# Altium schematic sheet Power Regulation.SchDoc
size B; Organization: MASA; SheetNumber: 7; SheetTotal: 7
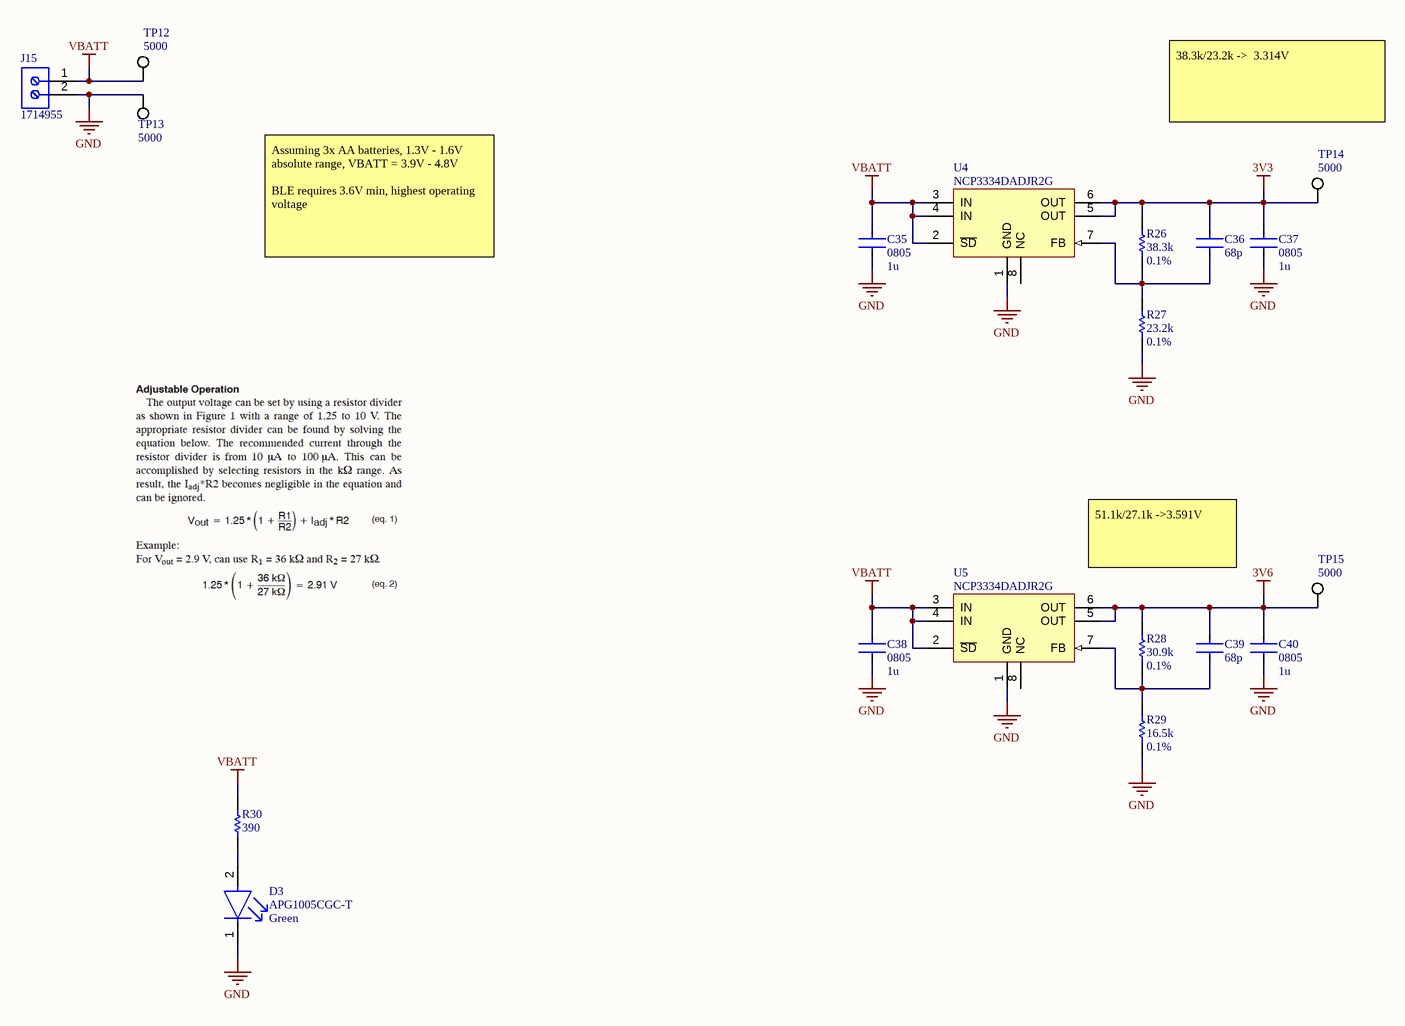
[diagram p0: Power Regulation.SchDoc]

## Parts
C35  value 1u  Package: 0805  [FP-0805-Capacitor-CL21-IPC_B]  (hidden comment: Ceramic Capacitor 0805)
C36  value 68p  [FP-0603-Capacitor-CL10-IPC_B]  (hidden comment: Ceramic Capacitor 0603)
C37  value 1u  Package: 0805  [FP-0805-Capacitor-CL21-IPC_B]  (hidden comment: Ceramic Capacitor 0805)
C38  value 1u  Package: 0805  [FP-0805-Capacitor-CL21-IPC_B]  (hidden comment: Ceramic Capacitor 0805)
C39  value 68p  [FP-0603-Capacitor-CL10-IPC_B]  (hidden comment: Ceramic Capacitor 0603)
C40  value 1u  Package: 0805  [FP-0805-Capacitor-CL21-IPC_B]  (hidden comment: Ceramic Capacitor 0805)
D3  APG1005CGC-T  Color: Green  [FP-APG1005CGC-T-MFG]
J15  1714955  [1714955]
R26  value 38.3k  Tolerance: 0.1%  [RESC1608X55X25NL10T15]  (hidden comment: RC0603FR-072K2L)
R27  value 23.2k  Tolerance: 0.1%  [RESC1608X55X25NL10T15]  (hidden comment: RC0603FR-072K2L)
R28  value 30.9k  Tolerance: 0.1%  [RESC1608X55X25NL10T15]  (hidden comment: RC0603FR-072K2L)
R29  value 16.5k  Tolerance: 0.1%  [RESC1608X55X25NL10T15]  (hidden comment: RC0603FR-072K2L)
R30  value 390  [RESC1608X55X25NL10T15]  (hidden comment: RC0603FR-072K2L)
TP12  5000  [FP-5000-MFG]
TP13  5000  [FP-5000-MFG]
TP14  5000  [FP-5000-MFG]
TP15  5000  [FP-5000-MFG]
U4  NCP3334DADJR2G  [NCP3334DADJR2G]
U5  NCP3334DADJR2G  [NCP3334DADJR2G]

## Nets
3V3: C36.1 C37.1 R26.2 TP14.1 U4.5(OUT) U4.6(OUT)
3V6: C39.1 C40.1 R28.2 TP15.1 U5.5(OUT) U5.6(OUT)
GND: C35.2 C37.2 C38.2 C40.2 D3.1(C) J15.2 R27.1 R29.1 TP13.1 U4.1(GND) U5.1(GND)
VBATT: C35.1 C38.1 J15.1 R30.2 TP12.1 U4.2(~{SD}) U4.3(IN) U4.4(IN) U5.2(~{SD}) U5.3(IN) U5.4(IN)
NetC36_2: C36.2 R26.1 R27.2 U4.7(FB)
NetC39_2: C39.2 R28.1 R29.2 U5.7(FB)
NetD3_2: D3.2(A) R30.1

Not connected (* = marked no-connect by the designer): U4 8(NC); U5 8(NC)

## Notes on the sheet
- 38.3k/23.2k ->  3.314V
- Assuming 3x AA batteries, 1.3V - 1.6V absolute range, VBATT = 3.9V - 4.8V
  BLE requires 3.6V min, highest operating voltage
- 51.1k/27.1k ->3.591V
- DWG. NO.
- REV.
- SHT.
- THIS DOCUMENT AND THE DATA DISCLOSED HEREIN OR HEREWITH IS THE PROPERTY OF ALTIUM LIMITED AND MAY BE FREELY DISTRIBUTED IN WHOLE. NO RIGHTS ARE RESERVED OR EXPRESS OR IMPLIED WARANTEE GIVEN.
- REVISION
- DESCRIPTION
- DATE
- APPROVED
- ENG:
- APPROVALS
- PROJECT
- DSN:
- CHK:
- REFERENCE DOCUMENTS
- PROJECT REVISION:
- TITLE
- DOCUMENT REVISION:
- DESIGN ITEM:
- BOM:
- FAB DWG:
- PCB DWG:
- ASSY DWG:
- SCALE:
- SIZE
- B
- CAGE CODE
- FILE NAME
- DWG NO.
- SHEET
- OF
- REV

## Library data of the parts
C35 C37 C38 C40 = Ceramic Capacitor 0805: CAP CER 50V X7R 0805; Manufacturer: KEMET; Manufacturer Part Number: C0603C104K5RACTU; Tolerance: 0.1; Temperature Coefficient: 30ppm/°C; Automotive Grade: Grade 1; Temperature: -55°C to +125°C; RoHS: TRUE; Material: Ceramic; Temperature Range High: +125°C; Lead Free: Yes; Octopart: https://octopart.com/c0603c104k5ractu-kemet-139244; Digikey Description: CAP CER 0.1UF 50V X7R 0603; Category: Cap; ComponentLink2Description: Datasheet; Temperature Range Low: -55°C; Device Class L1: Passive Components; Voltage Rating: 50 V; Automotive: Yes; Device Class L3: Ceramic Capacitors; ComponentLink2URL: https://api.kemet.com/component-edge/download/datasheet/C0603C100J5GACAUTO.pdf; Device Class L2: Capacitors; Temperature Characteristic: X7R; Height: 0.87mm; Supplier 1: Arrow Electronics; Supplier Part Number 1: CL21B105KBFNNNG
C36 C39 = Ceramic Capacitor 0603: CAP CER 50V X7R 0603; Manufacturer: KEMET; Manufacturer Part Number: C0603C104K5RACTU; Tolerance: 0.1; Temperature Coefficient: 30ppm/°C; Automotive Grade: Grade 1; Temperature: -55°C to +125°C; RoHS: TRUE; Material: Ceramic; Temperature Range High: +125°C; Lead Free: Yes; Octopart: https://octopart.com/c0603c104k5ractu-kemet-139244; Digikey Description: CAP CER 0.1UF 50V X7R 0603; Category: Cap; Package: C0603C-CF; ComponentLink2Description: Datasheet; Temperature Range Low: -55°C; Device Class L1: Passive Components; Voltage Rating: 50 V; Automotive: Yes; Device Class L3: Ceramic Capacitors; ComponentLink2URL: https://api.kemet.com/component-edge/download/datasheet/C0603C100J5GACAUTO.pdf; Device Class L2: Capacitors; Temperature Characteristic: X7R; Height: 0.87mm; Supplier 1: Mouser; Supplier Part Number 1: 80-C0201C120K3G
D3 = APG1005CGC-T: LED GREEN CLEAR CHIP SMD; Forward Voltage: 2V; Lens Color: Colorless; Test Current: 20mA; Dominant Wavelength: 571nm; Viewing Angle: 120°; Luminous Intensity: 35mcd; Width: 0.5mm; Case Code (Imperial): 0402; Package Quantity: 1; Case/Package: 0402; Packaging: Tape and Reel; Height: 0.25mm; Mount: Surface Mount; Case Code (Metric): 1005; Length: 1mm; Lead Free: Lead Free; Lens Transparency: Clear; Supplier 1: Digi-Key; Supplier Part Number 1: 754-1811-1-ND
J15 = 1714955: PC Terminal Block, Pitch 6.35 mm, 1 x 2 Position, Height 21.5 mm, Tail Lenght 5.1 mm, RoHS, Bulk; Manufacturer: Phoenix Contact; Package Description: PC Terminal Block, Pitch 6.35 mm, 1 x 2 Position, Height 21.5 mm, Tail Lenght 5.1 mm; Datasheet URL: http://media.digikey.com/pdf/Data%20Sheets/Phoenix%20Contact%20PDFs/1714955.pdf; Package Reference: 1714955; Manufacturer URL: http://www.phoenixcontact.com/; Datasheet Version: 02/2010; Mounting Technology: ThroughHole; Supplier 1: Arrow Electronics; Supplier Part Number 1: 1714955
R26-R30 = Resistor 0603: Thick Film Resistor, 2.2 KOhm, 100 mW, 50 V, +/- 1%, -55 to 155 degC, 2-Pin SMD (0603), RoHS, Tape and Reel; Manufacturer: Yageo; Temperature Coefficient: 100PPM/C; Voltage Rating: 50V; Power Rating: 100mW; Datasheet Version: Rev. 7, 05/2017; Case Code - mm: 1608; Series: RC; Mounting Technology: SurfaceMount; Package Description: 2-Pin Surface Mount Device, Body 1.6 x 0.8 mm; Case Code - in: 0603; Package Reference: 0603; Product: ThickFilmResistorsGeneralPurpose; Manufacturer URL: http://www.yageo.com/; Termination Style: SMD/SMT; Operating Temperature Range: -55Cto+155C; Datasheet URL: http://www.yageo.com/documents/recent/PYu-RC_Group_51_RoHS_L_7.pdf; Packaging: Reel
  R30: Tolerance: 1%
TP12-TP15 = 5000: Red PC Test Point, Miniature Phosphor Bronze Silver Plating Through Hole Mounting Type; Connector Type: Interconnection Device; Contact Finish - Termination: Silver (Ag); Reach SVHC Compliant: Yes; JESD-609 Code: e4; RoHS Compliant: Yes; Pins: 1; Mounting Technology: THT; Supplier 1: Future Electronics; Supplier Part Number 1: 8000564
U4 U5 = NCP3334DADJR2G: Linear Voltage Regulator IC Positive Adjustable 1 Output 500mA 8-SOIC; Supplier 1: Arrow Electronics; Supplier Part Number 1: NCP3334DADJR2G